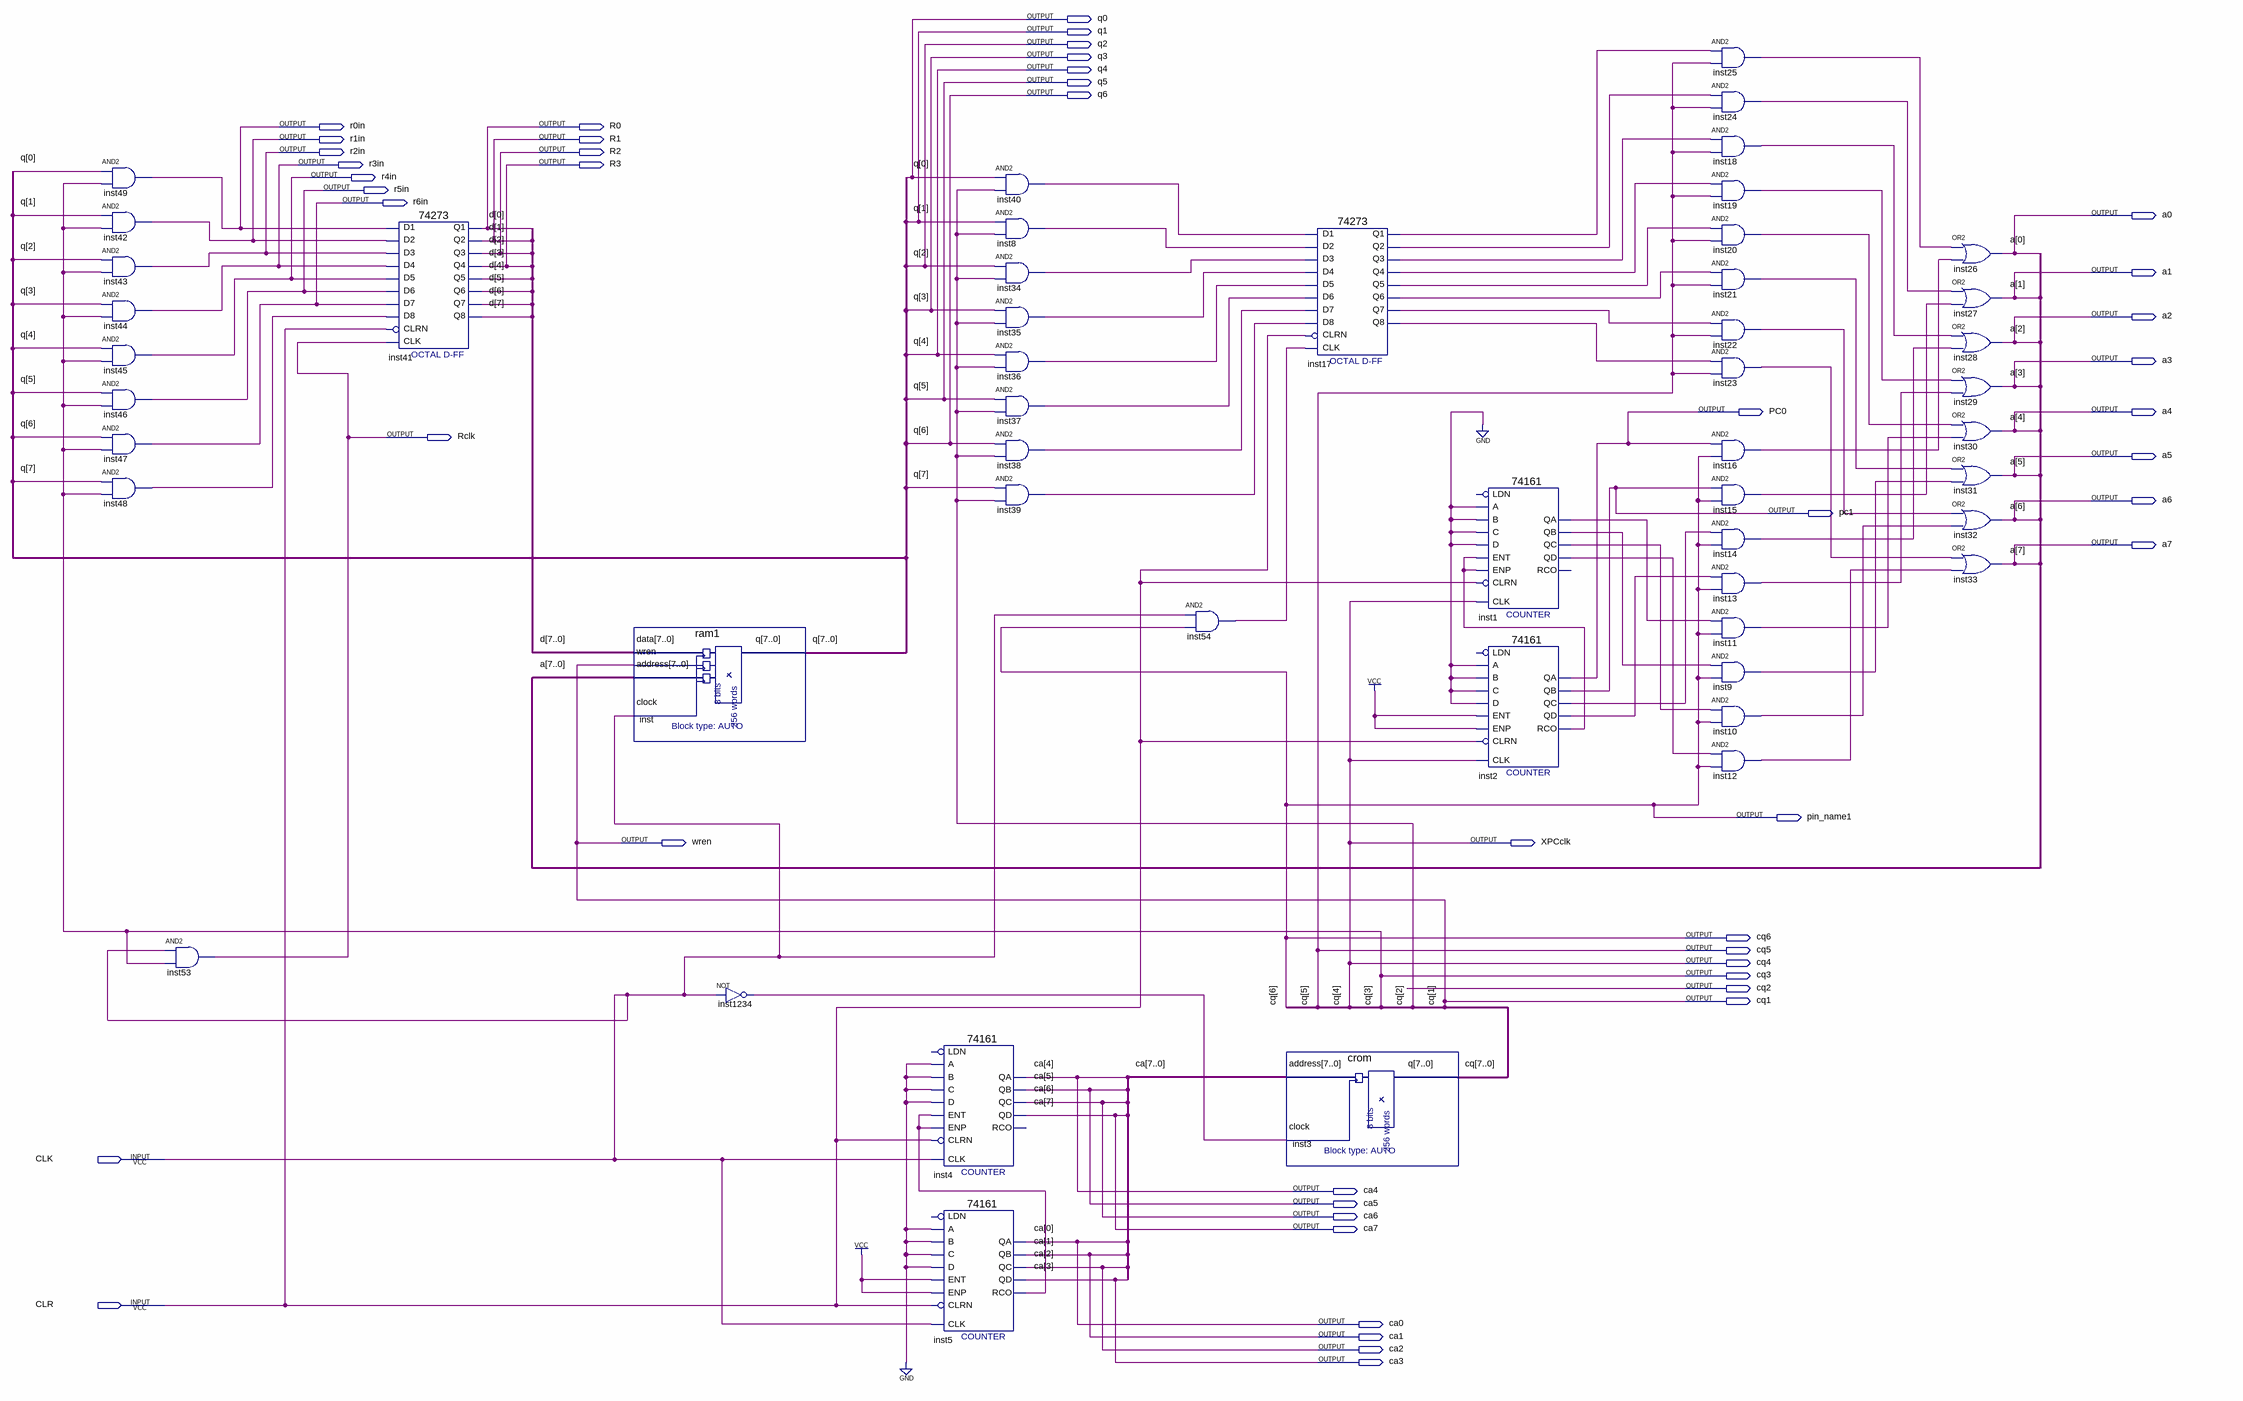
[diagram p0: schematic sheet]
// Quartus schematic exp2.bdf as structural Verilog: 51 symbols, 48 pins
module exp2 (
  input  CLK,
  input  CLR,
  output q0,
  output q1,
  output q2,
  output q3,
  output q4,
  output q5,
  output q6,
  output r0in,
  output R0,
  output r1in,
  output R1,
  output r2in,
  output R2,
  output r3in,
  output R3,
  output r4in,
  output r5in,
  output r6in,
  output a0,
  output a1,
  output a2,
  output a3,
  output PC0,
  output a4,
  output Rclk,
  output a5,
  output a6,
  output pc1,
  output a7,
  output pin_name1,
  output wren,
  output XPCclk,
  output cq6,
  output cq5,
  output cq4,
  output cq3,
  output cq2,
  output cq1,
  output ca4,
  output ca5,
  output ca6,
  output ca7,
  output ca0,
  output ca1,
  output ca2,
  output ca3
);

  wire inst1_qa, inst1_qb, inst1_qc, inst1_qd, inst2_qc, inst2_qd, inst2_rco, inst5_rco, inst8_out,
       inst9_out, inst10_out, inst11_out, inst12_out, inst13_out, inst14_out, inst15_out, inst16_out,
       inst17_q1, inst17_q2, inst17_q3, inst17_q4, inst17_q5, inst17_q6, inst17_q7, inst17_q8, inst18_out,
       inst19_out, inst20_out, inst21_out, inst22_out, inst23_out, inst24_out, inst25_out, inst34_out,
       inst35_out, inst36_out, inst37_out, inst38_out, inst39_out, inst40_out, inst48_out, inst54_out,
       inst1234_out;
  wire [7:0] cq;
  wire [7:4] d;
  wire [7:7] q;

  and inst49 (r0in, q0, cq3);
  and inst42 (r1in, q1, cq3);
  and inst43 (r2in, q2, cq3);
  and inst44 (r3in, q3, cq3);
  and inst45 (r4in, q4, cq3);
  and inst46 (r5in, q5, cq3);
  and inst47 (r6in, q6, cq3);
  and inst48 (inst48_out, q[7], cq3);
  and inst53 (Rclk, CLK, cq3);
  \74273  inst41 (
    .D2(r1in), .D3(r2in), .D1(r0in), .D4(r3in), .D7(r6in), .D6(r5in), .D5(r4in), .D8(inst48_out), .CLK(Rclk),
    .CLRN(CLR), .Q4(R3), .Q1(R0), .Q2(R1), .Q3(R2), .Q6(d[5]), .Q5(d[4]), .Q7(d[6]), .Q8(d[7]));
  ram1 inst (
    .data({d, R3, R2, R1, R0}), .wren(cq1), .address({a7, a6, a5, a4, a3, a2, a1, a0}), .clock(CLK),
    .q({q[7], q6, q5, q4, q3, q2, q1, q0}));
  not inst1234 (inst1234_out, CLK);
  \74161  inst4 (
    .CLRN(CLR), .CLK(CLK), .ENP(inst5_rco), .A(1'b0), .D(1'b0), .ENT(inst5_rco), .B(1'b0), .C(1'b0),
    .QD(ca7), .QC(ca6), .QB(ca5), .QA(ca4));  // open: LDN, RCO
  \74161  inst5 (
    .CLRN(CLR), .CLK(CLK), .ENP(1'b1), .A(1'b0), .D(1'b0), .ENT(1'b1), .B(1'b0), .C(1'b0), .QD(ca3),
    .QC(ca2), .QB(ca1), .QA(ca0), .RCO(inst5_rco));  // open: LDN
  and inst40 (inst40_out, q0, cq2);
  and inst8 (inst8_out, q1, cq2);
  and inst34 (inst34_out, q2, cq2);
  and inst35 (inst35_out, q3, cq2);
  and inst36 (inst36_out, q4, cq2);
  and inst37 (inst37_out, q5, cq2);
  and inst38 (inst38_out, q6, cq2);
  and inst39 (inst39_out, q[7], cq2);
  and inst54 (inst54_out, CLK, cq6);
  \74273  inst17 (
    .D2(inst8_out), .D3(inst34_out), .D1(inst40_out), .D4(inst35_out), .D7(inst38_out), .D6(inst37_out),
    .D5(inst36_out), .D8(inst39_out), .CLK(inst54_out), .CLRN(CLR), .Q4(inst17_q4), .Q1(inst17_q1),
    .Q2(inst17_q2), .Q3(inst17_q3), .Q6(inst17_q6), .Q5(inst17_q5), .Q7(inst17_q7), .Q8(inst17_q8));
  crom inst3 (
    .address({ca7, ca6, ca5, ca4, ca3, ca2, ca1, ca0}), .clock(inst1234_out),
    .q({cq[7], cq6, cq5, cq4, cq3, cq2, cq1, cq[0]}));
  \74161  inst1 (
    .CLRN(CLR), .CLK(cq4), .ENP(inst2_rco), .A(1'b0), .D(1'b0), .ENT(inst2_rco), .B(1'b0), .C(1'b0),
    .QD(inst1_qd), .QC(inst1_qc), .QB(inst1_qb), .QA(inst1_qa));  // open: LDN, RCO
  \74161  inst2 (
    .CLRN(CLR), .CLK(cq4), .ENP(1'b1), .A(1'b0), .D(1'b0), .ENT(1'b1), .B(1'b0), .C(1'b0), .QD(inst2_qd),
    .QC(inst2_qc), .QB(pc1), .QA(PC0), .RCO(inst2_rco));  // open: LDN
  and inst25 (inst25_out, inst17_q1, cq5);
  and inst24 (inst24_out, inst17_q2, cq5);
  and inst18 (inst18_out, inst17_q3, cq5);
  and inst19 (inst19_out, inst17_q4, cq5);
  and inst20 (inst20_out, inst17_q5, cq5);
  and inst21 (inst21_out, inst17_q6, cq5);
  and inst22 (inst22_out, inst17_q7, cq5);
  and inst23 (inst23_out, inst17_q8, cq5);
  and inst16 (inst16_out, PC0, cq6);
  and inst15 (inst15_out, pc1, cq6);
  and inst14 (inst14_out, inst2_qc, cq6);
  and inst13 (inst13_out, inst2_qd, cq6);
  and inst11 (inst11_out, inst1_qa, cq6);
  and inst9 (inst9_out, inst1_qb, cq6);
  and inst10 (inst10_out, inst1_qc, cq6);
  and inst12 (inst12_out, inst1_qd, cq6);
  or inst26 (a0, inst25_out, inst16_out);
  or inst27 (a1, inst24_out, inst15_out);
  or inst28 (a2, inst18_out, inst14_out);
  or inst29 (a3, inst19_out, inst13_out);
  or inst30 (a4, inst20_out, inst11_out);
  or inst31 (a5, inst21_out, inst9_out);
  or inst32 (a6, inst22_out, inst10_out);
  or inst33 (a7, inst23_out, inst12_out);

  assign pin_name1 = cq6;
  assign wren = cq1;
  assign XPCclk = cq4;

  // Other names for the same wires on the sheet: d[3:0] = {R3, R2, R1, R0}
endmodule
